# EAGLE design Hat_MCP3912 (EAGLE 6.5.0)
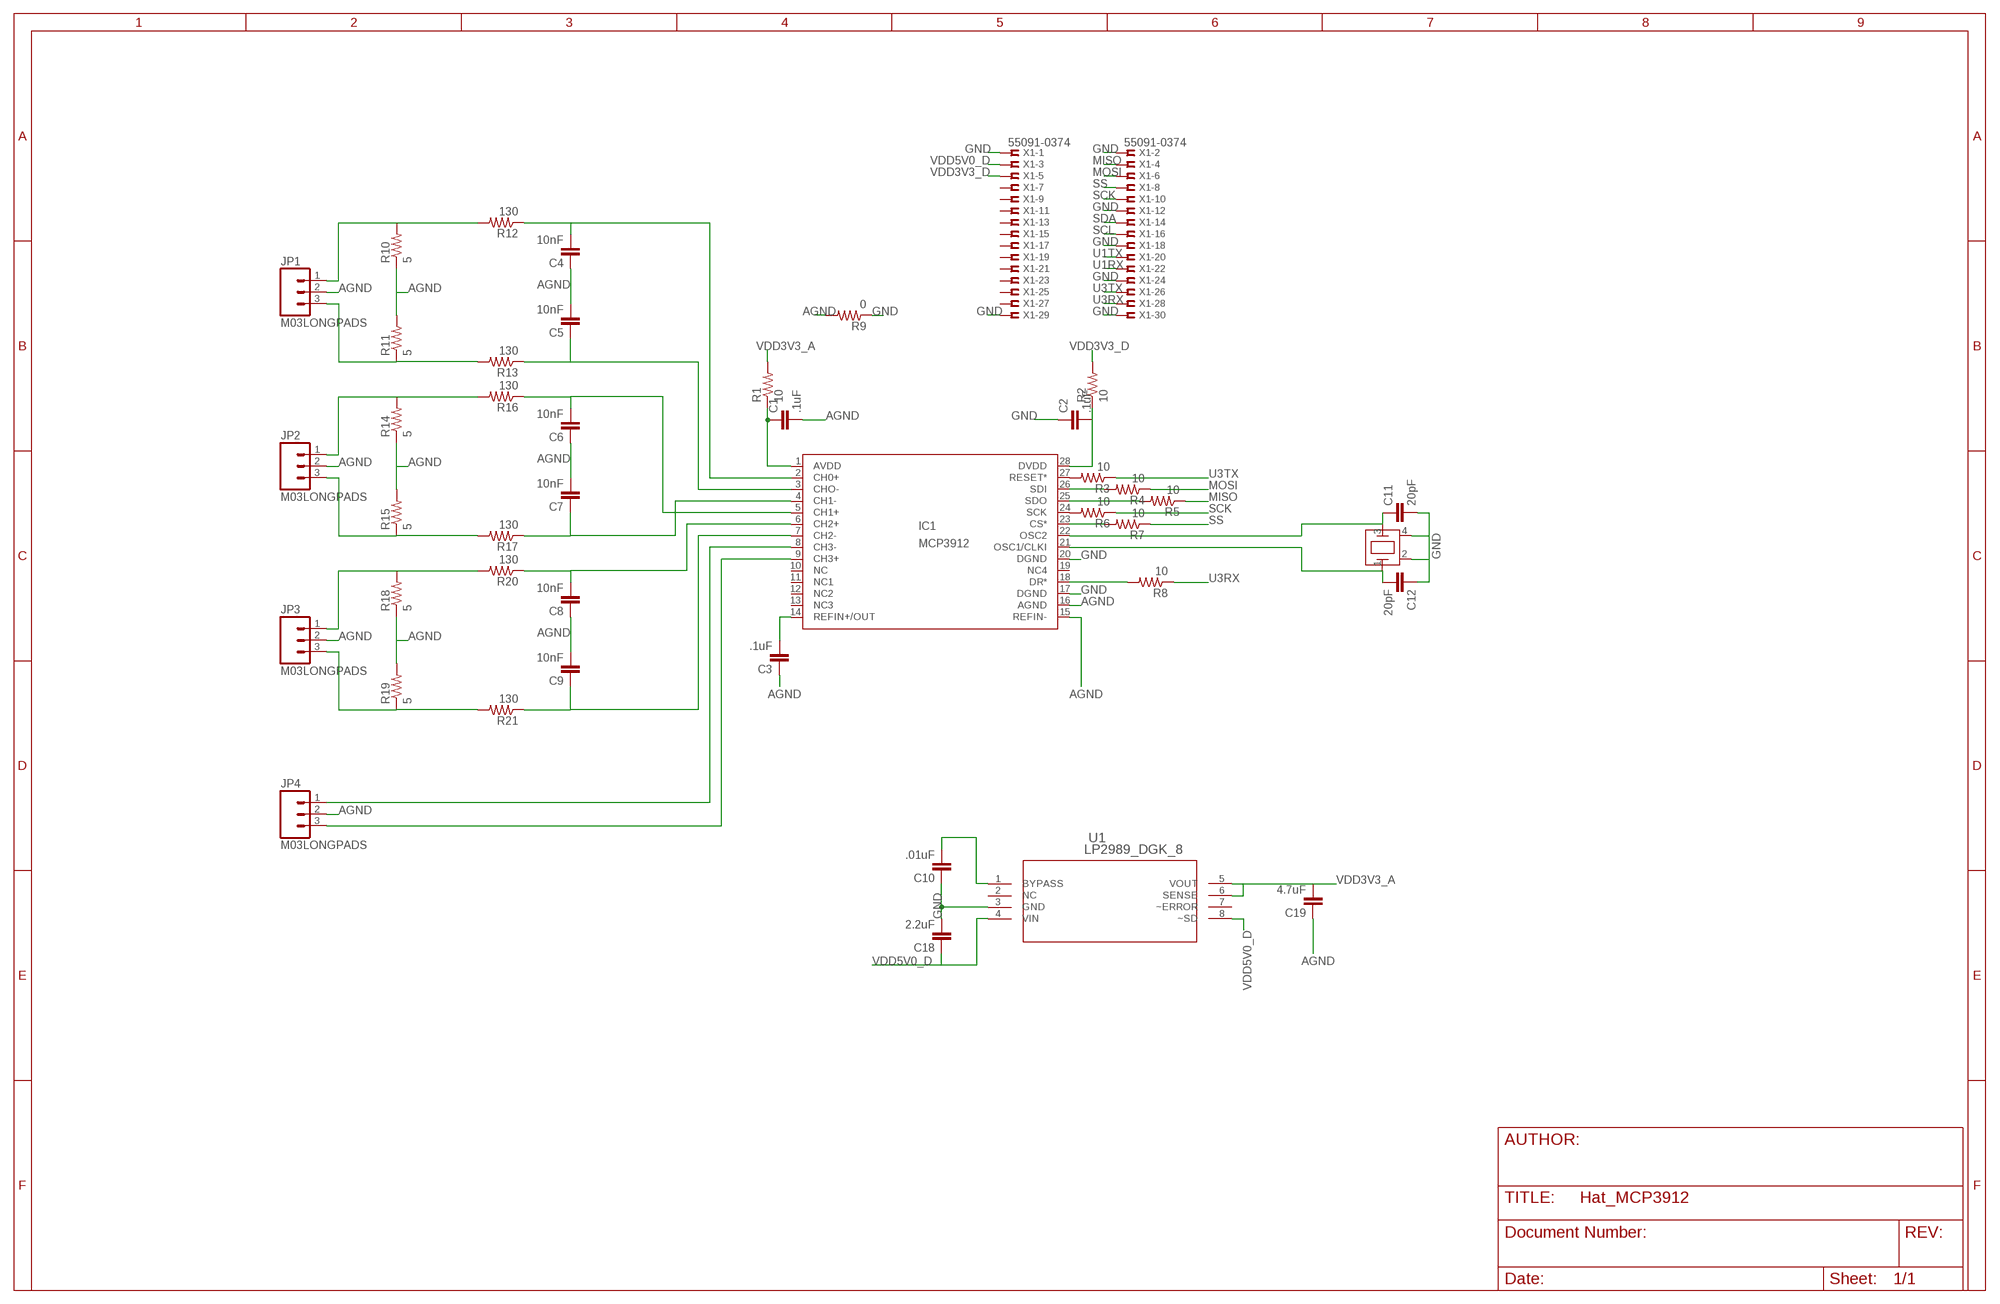
[diagram p0: schematic, sheet 1]

## Parts
C1  .1uF  CAP0805  [0805]
C2  .1uF  CAP0805  [0805]
C3  .1uF  CAP0805  [0805]
C4  10nF  CAP0805  [0805]
C5  10nF  CAP0805  [0805]
C6  10nF  CAP0805  [0805]
C7  10nF  CAP0805  [0805]
C8  10nF  CAP0805  [0805]
C9  10nF  CAP0805  [0805]
C10  .01uF  CAP0805  [0805]
C11  20pF  CAP0805  [0805]
C12  20pF  CAP0805  [0805]
C18  2.2uF  CAP0805  [0805]
C19  4.7uF  CAP0805  [0805]
IC1  MCP3912  [SSOP28]
JP1  M03LONGPADS  [1X03_LONGPADS]
JP2  M03LONGPADS  [1X03_LONGPADS]
JP3  M03LONGPADS  [1X03_LONGPADS]
JP4  M03LONGPADS  [1X03_LONGPADS]
R1  10  RESISTOR0805-RES  [0805]
R2  10  RESISTOR0805-RES  [0805]
R3  10  RESISTOR0805-RES  [0805]
R4  10  RESISTOR0805-RES  [0805]
R5  10  RESISTOR0805-RES  [0805]
R6  10  RESISTOR0805-RES  [0805]
R7  10  RESISTOR0805-RES  [0805]
R8  10  RESISTOR0805-RES  [0805]
R9  0  RESISTOR0805-RES  [0805]
R10  5  RESISTOR0805-RES  [0805]
R11  5  RESISTOR0805-RES  [0805]
R12  130  RESISTOR0805-RES  [0805]
R13  130  RESISTOR0805-RES  [0805]
R14  5  RESISTOR0805-RES  [0805]
R15  5  RESISTOR0805-RES  [0805]
R16  130  RESISTOR0805-RES  [0805]
R17  130  RESISTOR0805-RES  [0805]
R18  5  RESISTOR0805-RES  [0805]
R19  5  RESISTOR0805-RES  [0805]
R20  130  RESISTOR0805-RES  [0805]
R21  130  RESISTOR0805-RES  [0805]
U1  LP2989_DGK_8  [MUA08A]
U$1  7M-12.000MEEQ-T  [7M-CRYSTAL]
X1  55091-0374  [55091-0374]

## Nets
AGND: C1.2 C3.1 C4.1 C5.2 C6.1 C7.2 C8.1 C9.2 C19.1 IC1.15(REFIN-) IC1.16(AGND) JP1.2 JP2.2 JP3.2 JP4.2 R9.2 R10.1 R11.2 R14.1 R15.2 R18.1 R19.2
GND: C2.1 C10.1 C11.2 C12.1 C18.2 IC1.17(DGND) IC1.20(DGND) R9.1 U1.3(GND) U$1.2(GND1) U$1.4(GND2) X1.1 X1.2 X1.12 X1.18 X1.24 X1.29 X1.30
MISO: R5.1 X1.4
MOSI: R4.1 X1.6
N$1: C1.1 IC1.1(AVDD) R1.1
N$2: IC1.27(RESET*) R3.2
N$3: IC1.26(SDI) R4.2
N$4: IC1.25(SDO) R5.2
N$5: IC1.24(SCK) R6.2
N$6: IC1.23(CS*) R7.2
N$7: IC1.18(DR*) R8.2
N$8: C2.2 IC1.28(DVDD) R2.1
N$9: C3.2 IC1.14(REFIN+/OUT)
N$10: JP1.1 R10.2 R12.2
N$11: JP1.3 R11.1 R13.2
N$12: JP2.1 R14.2 R16.2
N$13: C4.2 IC1.2(CH0+) R12.1
N$14: C5.1 IC1.3(CHO-) R13.1
N$15: JP2.3 R15.1 R17.2
N$16: C6.2 IC1.5(CH1+) R16.1
N$17: C7.1 IC1.4(CH1-) R17.1
N$18: JP3.1 R18.2 R20.2
N$19: JP3.3 R19.1 R21.2
N$20: C8.2 IC1.6(CH2+) R20.1
N$21: C9.1 IC1.7(CH2-) R21.1
N$22: IC1.8(CH3-) JP4.1
N$23: IC1.9(CH3+) JP4.3
N$24: C10.2 U1.1(BYPASS)
N$26: C11.1 IC1.22(OSC2) U$1.3(OSC2)
N$27: C12.2 IC1.21(OSC1/CLKI) U$1.1(OSC1)
SCK: R6.1 X1.10
SCL: X1.16
SDA: X1.14
SS: R7.1 X1.8
U1RX: X1.22
U1TX: X1.20
U3RX: R8.1 X1.28
U3TX: R3.1 X1.26
VDD3V3_A: C19.2 R1.2 U1.5(VOUT) U1.6(SENSE)
VDD3V3_D: R2.2 X1.5
VDD5V0_D: C18.1 U1.4(VIN) U1.8(~SD) X1.3
Unconnected: IC1.10(NC) IC1.11(NC1) IC1.12(NC2) IC1.13(NC3) IC1.19(NC4) U1.2(NC) U1.7(~ERROR) X1.7 X1.9 X1.11 X1.13 X1.15 X1.17 X1.19 X1.21 X1.23 X1.25 X1.27

## Library data of the parts
C1-C12 C18 C19 = SensorCape:CAP: Capacitor Standard 0603 ceramic capacitor, and 0.1" leaded capacitor.
IC1 = SensorCape:MCP3912: edit this description Auto generated by make-symbol-device-package-bsdl.ulp Rev. 43 Source:
JP1-JP4 = SensorCape:M03: Header 3 Standard 3-pin 0.1" header. Use with straight break away headers (SKU : PRT-00116), right angle break away headers (PRT-00553), swiss pins (PRT-00743), machine pins (PRT-00117), and female headers (PRT-00115). Molex polarized connector foot print use with SKU : PRT-08232 with associated crimp pins and housings.
R1-R21 = SensorCape:RESISTOR: Resistor Basic schematic elements and footprints for 0603, 1206, and PTH resistors.
U1 = SensorCape:LP2989_DGK_8; BASE_PN: LP2989; COMP: TypeLDO; LIBRARY: ReferenceLP2989AIMM; PARTNUMBER: LP2989AIMM-25; PIN: Count8; SYMBOL: NameLP2989AIMM-25; TYPE: LP2989AIMM-2.5; VENDOR: NationalSemiconductor; VERSION: 1
U$1 = SensorCape:7M-12.000MEEQ-T
X1 = SensorCape:55091-0374: 0.635 mm PITCH B TO B CONN. Source: http://www.molex.com/pdm_docs/sd/550911609_sd.pdf; OC_FARNELL: unknown; OC_NEWARK: unknown

## Board
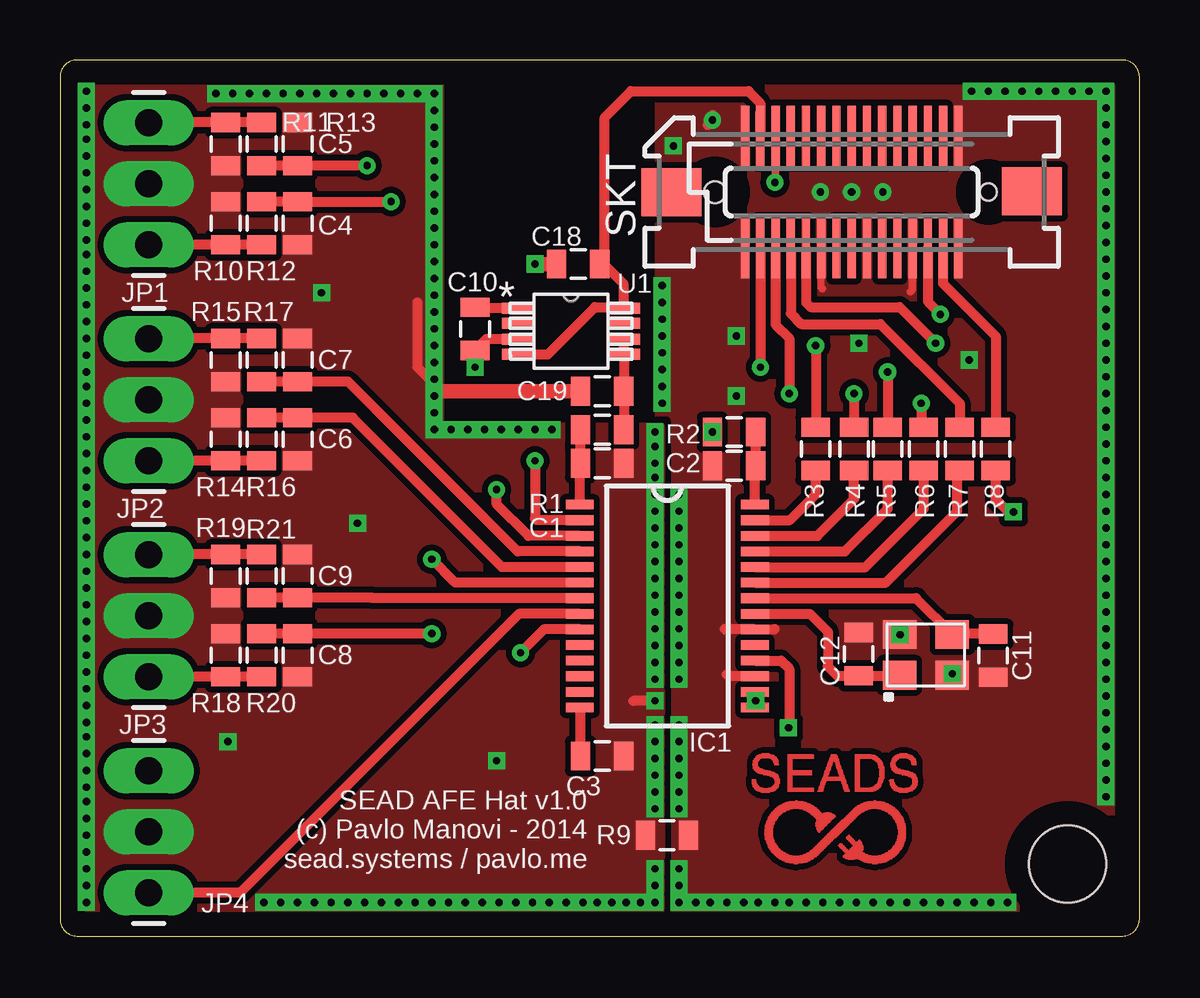
[diagram p1: board, top side]
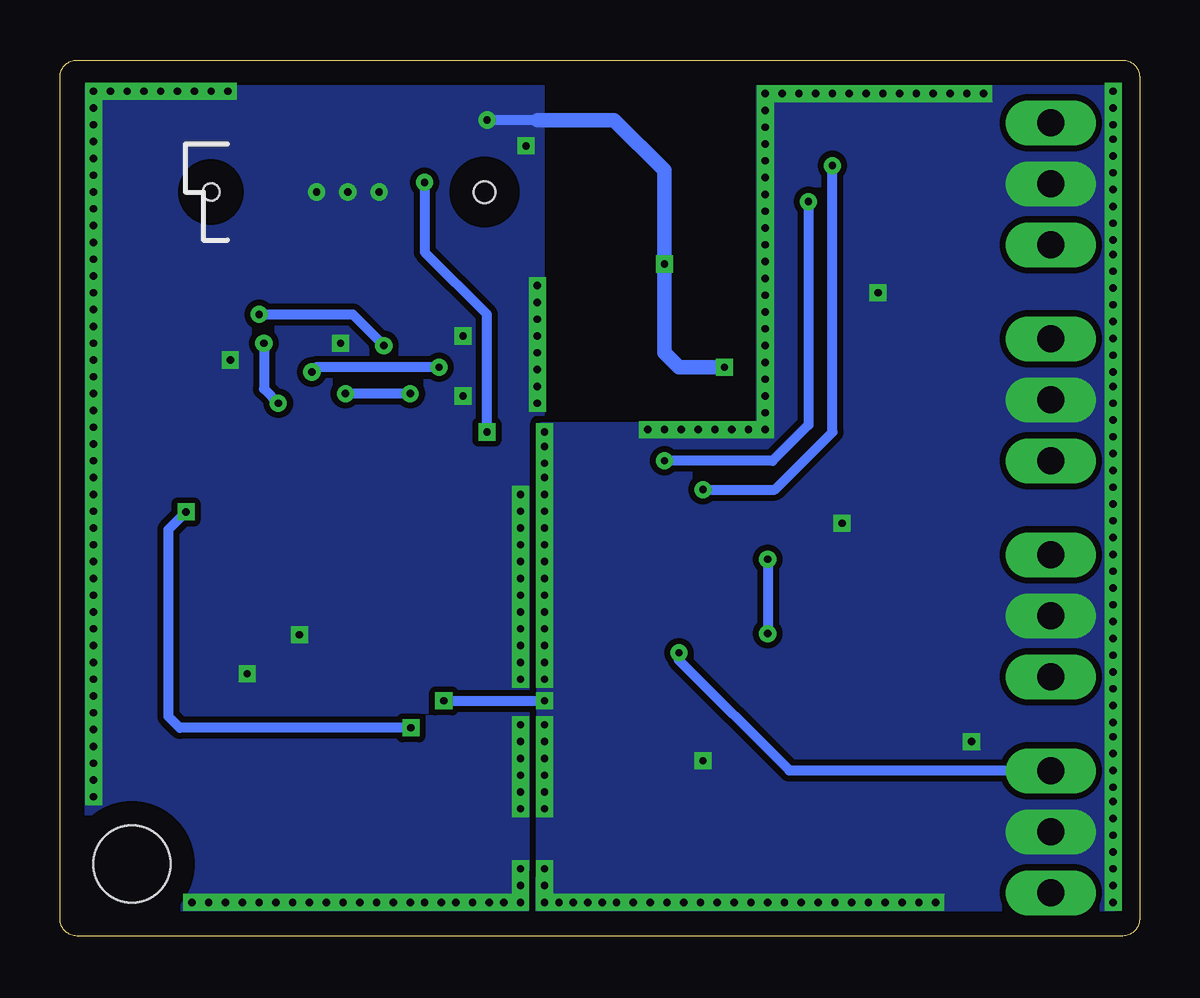
[diagram p2: board, bottom side, seen from below]

Size 45 x 36.5 mm. Coordinates in mm from the lower left corner, seen from the top.
Outline: 0,35.79 0,0.71 arc90 0.71,0 44.29,0 arc90 45,0.71 45,35.79 arc90 44.29,36.5 0.71,36.5 arc90 0,35.79
Copper layers (1*16): Top 0.035mm / dielectric 1.5mm / Bottom 0.035mm
Design rules "default": minimum track width 10mil, minimum drill 24mil, track to track 8mil, track to pad 8mil, pad to pad 8mil, via to via 8mil, smd to smd 8mil, copper to edge 40mil, drill to drill 8mil, minimum pad ring 10mil, minimum via ring 8mil, stop-mask expansion 4mil, vias tented up to drill 0mil, thermal gap 10mil
Holes 3.2 mm at 42,3

### Footprints (pad centres in the part's own frame; a part is rotated, then mirrored left to right if it is on the bottom)
0805 = smd 0.8 x 1.2: 1 -0.9,0; 2 0.9,0
SSOP28 = smd 1.154 x 0.4: 1 -3.65,4.225; 2 -3.65,3.575; 3 -3.65,2.925; 4 -3.65,2.275; 5 -3.65,1.625; 6 -3.65,0.975; 7 -3.65,0.325; 8 -3.65,-0.325; 9 -3.65,-0.975; 10 -3.65,-1.625; 11 -3.65,-2.275; 12 -3.65,-2.925; 13 -3.65,-3.575; 14 -3.65,-4.225; 15 3.65,-4.225; 16 3.65,-3.575; 17 3.65,-2.925; 18 3.65,-2.275; 19 3.65,-1.625; 20 3.65,-0.975; 21 3.65,-0.325; 22 3.65,0.325; 23 3.65,0.975; 24 3.65,1.625; 25 3.65,2.275; 26 3.65,2.925; 27 3.65,3.575; 28 3.65,4.225
1X03_LONGPADS = drill 1.118 pad 1.88 long: 1 0,0; 2 2.54,0; 3 5.08,0
MUA08A = smd 1.372 x 0.457: 1 -2.184,0.965; 2 -2.184,0.33; 3 -2.184,-0.33; 4 -2.184,-0.965; 5 2.184,-0.965; 6 2.184,-0.33; 7 2.184,0.33; 8 2.184,0.965
7M-CRYSTAL = smd 1.4 x 1.2: 1 -1.1,-0.85; 2 1.1,-0.85; 3 1.1,0.85; 4 -1.1,0.85
55091-0374 = smd 0.35 x 2.5: 1 -4.445,2.35; 2 -4.445,-2.35; 3 -3.81,2.35; 4 -3.81,-2.35; 5 -3.175,2.35; 6 -3.175,-2.35; 7 -2.54,2.35; 8 -2.54,-2.35; 9 -1.905,2.35; 10 -1.905,-2.35; 11 -1.27,2.35; 12 -1.27,-2.35; 13 -0.635,2.35; 14 -0.635,-2.35; 15 0,2.35; 16 0,-2.35; 17 0.635,2.35; 18 0.635,-2.35; 19 1.27,2.35; 20 1.27,-2.35; 21 1.905,2.35; 22 1.905,-2.35; 23 2.54,2.35; 24 2.54,-2.35; 25 3.175,2.35; 26 3.175,-2.35; 27 3.81,2.35; 28 3.81,-2.35; 29 4.445,2.35; 30 4.445,-2.35 | smd 2.5 x 2: M1 -7.513,0; M2 7.513,0.025 | hole 0.9: -5.7,0 | hole 0.7: 5.7,0

### Placement (x,y rotation side)
C1  22.6,19.7 0 top
C2  28.1,19.6 0 top
C3  22.6,7.5 180 top
C4  9.9,29.7 90 top
C5  9.9,33 90 top
C6  9.9,20.7 90 top
C7  9.9,24 90 top
C8  9.9,11.7 90 top
C9  9.9,15 90 top
C10  17.3,25.3 90 top
C11  38.9,11.68 270 top
C12  33.29,11.74 270 top
C18  21.6,28 180 top
C19  22.6,22.7 0 top
IC1  25.32,13.75 0 top
JP1  3.7,28.8 90 top
JP2  3.7,19.8 90 top
JP3  3.7,10.8 90 top
JP4  3.7,1.8 90 top
R1  22.6,21.1 0 top
R2  28.1,21 180 top
R3  31.5,20.3 270 top
R4  33.1,20.3 270 top
R5  34.5,20.3 270 top
R6  36,20.3 270 top
R7  37.5,20.3 270 top
R8  39,20.3 270 top
R9  25.3,4.2 180 top
R10  6.9,29.7 270 top
R11  6.9,33 270 top
R12  8.4,29.7 270 top
R13  8.4,33 90 top
R14  6.9,20.7 270 top
R15  6.9,24 270 top
R16  8.4,20.7 270 top
R17  8.4,24 90 top
R18  6.9,11.7 270 top
R19  6.9,15 270 top
R20  8.4,11.7 270 top
R21  8.4,15 90 top
U1  21.3,25.2 0 top
U$1  36.1,11.71 0 top
X1  33,31 0 top

### Tracks (layer width: path | path; a pad name or v marks a point on that pad's centre or on a via)
AGND  (via drill 0.3)
  Top 0.406: IC1.16 IC1.15 29,9.55 v29,9.8 | v24.8,9.8 23.9,9.8 | 15.9,22.7 14.9,23.7 14.9,26.4 | v1.1,33.8 v1.1,33.2 | v1.1,32.5 v1.1,31.8 | v1.1,31.1 v1.1,30.4 | v1.1,29 v1.1,28.4 v1.1,27.7 | v1.1,24.9 v1.1,24.2 | v1.1,22.2 v1.1,21.5 | v1.1,20.8 v1.1,20.1 | v1.1,19.4 v1.1,18.7 | v1.1,15.9 v1.1,15.2 | v1.1,14.5 v1.1,13.8 | v1.1,13.1 v1.1,12.4 | v1.1,11.7 v1.1,11 | v1.1,10.3 v1.1,9.6 | v1.1,7.6 v1.1,6.9 | v1.1,4.9 v1.1,4.2 | v1.1,2.8 v1.1,2.1 v1.1,1.4
  Top 0.61: C19.1 15.9,22.7
  Bottom 0.406: v29,9.8 v24.8,9.8
  other vias: 9.9,1.4 10.6,1.4 11.3,1.4 12,1.4 12.7,1.4 13.4,1.4 14.1,1.4 14.8,1.4 15.5,1.4 16.2,1.4 16.9,1.4 17.6,1.4 18.3,1.4 19,1.4 19.7,1.4 20.4,1.4 21.1,1.4 21.8,1.4 22.4,1.4 23,1.4 23.6,1.4 24.2,1.4 9.2,1.4 8.5,1.4 1.1,3.5 1.1,5.6 1.1,6.2 1.1,8.3 1.1,8.9 1.1,16.6 1.1,17.3 1.1,18 1.1,22.9 1.1,23.5 1.1,25.6 1.1,26.3 1.1,27 1.1,29.7 1.1,35.2 1.1,34.5 24.8,10.7 24.8,11.4 24.8,12.1 24.8,12.8 24.8,13.5 24.8,14.2 24.8,14.9 24.8,15.6 24.8,16.3 24.8,17 24.8,17.7 24.8,18.4 24.8,19.1 24.8,19.7 24.8,20.4 24.8,21 18.2,7.3 7,8.1 24.8,8.8 24.8,8.1 24.8,7.4 24.8,6.7 24.8,6 24.8,5.3 24.8,2.8 24.8,2.1 15.6,35.1 15.6,34.4 15.6,33.7 15.6,33 15.6,32.3 15.6,31.6 15.6,30.9 15.6,30.2 15.6,29.5 15.6,28.8 15.6,28.1 15.6,27.4 15.6,26.7 15.6,26 15.6,25.3 15.6,24.6 15.6,23.9 15.6,23.2 15.6,22.5 15.6,21.8 15.6,21.1 16.3,21.1 17,21.1 17.7,21.1 18.4,21.1 19.1,21.1 19.8,21.1 20.5,21.1 24.8,1.4 14.9,35.1 14.2,35.1 13.5,35.1 12.8,35.1 12.1,35.1 11.4,35.1 10.7,35.1 10,35.1 9.3,35.1 8.6,35.1 7.9,35.1 7.2,35.1 6.5,35.1 12.4,17.2 10.9,26.8
  pour Top (isolate 0.254, no thermals): -0.9,37 15.8,37 15.8,21.2 25,21.2 25,0 -0.9,0
  pour Bottom (isolate 0.254, no thermals): -0.9,37 15.8,37.2 15.8,21.2 24.9,21.2 24.9,19.7 25,0 -0.9,0
GND  (via drill 0.3)
  Top 0.305: X1.12 31.71,27.05 31.79,26.98 | X1.24 35.52,26.92 35.45,26.85
  Top 0.406: 29.8,12.8 29.77,12.78 IC1.20 27.73,12.78 27.7,12.8 | IC1.17 27.88,10.82 27.8,10.9 | U1.3 17.77,24.87 C10.1 | v27.2,34 27.2,34.2 27,33.8
  Top 0.61: v19.8,28 C18.2 | C10.1 v17.3,23.7
  Bottom 0.406: 25.1,34 v27.2,34
  Bottom 0.61: 25.1,34 21.9,34 19.8,31.9 v19.8,28 19.8,24.3 19.2,23.7 v17.3,23.7
  other vias: 31.7,31 33,31 34.3,31 43.6,35.2 43.6,34.5 43.6,33.8 43.6,33.1 43.6,32.4 43.6,31.7 43.6,31 42.9,35.2 42.2,35.2 41.5,35.2 40.8,35.2 40.1,35.2 39.4,35.2 38.7,35.2 38,35.2 43.6,30.3 43.6,29.6 43.6,28.9 43.6,28.2 43.6,27.5 43.6,26.8 43.6,26.1 43.6,25.4 43.6,24.7 43.6,24 43.6,23.3 43.6,22.6 43.6,21.9 43.6,21.2 43.6,20.5 43.6,19.8 43.6,19.1 43.6,18.4 43.6,17.7 43.6,17 43.6,16.3 43.6,15.6 43.6,14.9 43.6,14.2 43.6,13.5 43.6,12.8 43.6,12.1 43.6,11.4 43.6,10.7 43.6,10 43.6,9.3 43.6,8.6 43.6,7.9 43.6,7.2 43.6,6.5 43.6,5.8 39.5,1.4 38.8,1.4 38.1,1.4 37.4,1.4 36.7,1.4 36,1.4 35.3,1.4 34.6,1.4 33.9,1.4 33.2,1.4 32.5,1.4 31.8,1.4 31.1,1.4 30.4,1.4 29.8,1.4 29.1,1.4 28.5,1.4 27.8,1.4 27.1,1.4 26.5,1.4 25.8,2.1 25.8,2.8 25.8,5.3 25.8,6 25.8,6.7 25.8,7.4 25.8,8.1 25.8,8.8 25.8,10.7 25.8,11.4 25.8,12.1 25.8,12.8 25.8,13.5 25.8,14.2 25.8,14.9 25.8,15.6 25.8,16.3 25.8,17 25.8,17.7 25.8,18.4 25.1,22.2 25.1,22.9 25.1,23.6 25.1,24.3 25.1,25 25.1,25.7 25.1,26.4 25.1,27.1 25.57,32.92 37.9,24 33.3,24.7 28.2,25 28.2,22.5 25.8,1.4 35.01,12.55 37.2,10.92
  pour Top (isolate 0.254, rank 2, no thermals): 25,37 45,37 45,0 25,0
  pour Bottom (isolate 0.254, rank 2, no thermals): 25,37 45,37 45,0 25,0
MISO  (via drill 0.3)
  Top 0.406: v34.5,23.5 R5.1 | X1.4 v29.19,23.71 v29.2,23.7
  Bottom 0.406: v29.2,23.7 34.3,23.7 v34.5,23.5
MOSI  (via drill 0.3)
  Top 0.406: v30.4,22.6 30.4,24.9 29.82,25.48 X1.6 | v33.1,22.6 R4.1
  Bottom 0.406: v30.4,22.6 v33.1,22.6
N$1
  Top 0.406: IC1.1 21.67,19.67 C1.1 R1.1
N$2
  Top 0.406: IC1.27 30.43,17.32 31.5,18.4 R3.2
N$3
  Top 0.406: IC1.26 31.57,16.68 33.1,18.2 R4.2
N$4
  Top 0.406: IC1.25 32.73,16.02 34.5,17.8 R5.2
N$5
  Top 0.406: IC1.24 33.58,15.38 36,17.8 R6.2
N$6
  Top 0.406: IC1.23 34.42,14.72 37.4,17.7 37.4,19.3 R7.2
N$7  (via drill 0.3)
  Top 0.406: R8.2 39,18.2 39.53,17.67 v39.75,17.67 | IC1.18 30.05,11.47 30.4,11.13 30.4,8.71 v30.37,8.68
  Bottom 0.406: v39.75,17.67 40.48,16.94 40.48,9.14 40.01,8.68 v30.37,8.68
N$8
  Top 0.406: IC1.28 28.97,19.57 C2.2 R2.1
N$9
  Top 0.406: C3.2 21.7,9.49 IC1.14
N$10
  Top 0.406: R12.2 R10.2 JP1.1
N$11
  Top 0.406: R13.2 R11.1 3.72,33.9 JP1.3
N$12
  Top 0.406: R16.2 R14.2 JP2.1
N$13  (via drill 0.3)
  Top 0.406: R12.1 C4.2 v13.8,30.6 | v19.8,19.8 19.8,17.4 19.88,17.32 IC1.2
  Bottom 0.406: v13.8,30.6 13.8,21.3 15.3,19.8 v19.8,19.8
N$14  (via drill 0.3)
  Top 0.406: R13.1 C5.1 v12.8,32.1 | IC1.3 19.52,16.68 18.2,18 v18.2,18.6
  Bottom 0.406: v18.2,18.6 15.2,18.6 12.8,21 v12.8,32.1
N$15
  Top 0.406: R17.2 R15.1 3.72,24.9 JP2.3
N$16
  Top 0.406: IC1.5 18.43,15.38 12.2,21.6 C6.2 R16.1
N$17
  Top 0.406: IC1.4 19.07,16.02 12,23.1 C7.1 R17.1
N$18
  Top 0.406: R20.2 R18.2 JP3.1
N$19
  Top 0.406: R21.2 R19.1 3.72,15.9 JP3.3
N$20  (via drill 0.3)
  Top 0.406: IC1.6 16.48,14.72 v15.5,15.7 | v15.5,12.6 C8.2 R20.1
  Bottom 0.406: v15.5,15.7 v15.5,12.6
N$21
  Top 0.406: IC1.7 13.03,14.07 13,14.1 C9.1 R21.1
N$22
  Top 0.406: IC1.8 19.12,13.43 7.5,1.8 JP4.1
N$23  (via drill 0.3)
  Top 0.406: IC1.9 20.18,12.78 v19.2,11.8
  Bottom 0.406: JP4.3 3.72,6.9 14.6,6.9 19.2,11.5 v19.2,11.8
N$24
  Top 0.406: U1.1 17.34,26.16 C10.2
N$25
  Top 0.025: 29.9,3.27 31.45,3.27
N$26
  Top 0.406: IC1.22 35.68,14.07 U$1.3 37.22,12.58 C11.1
N$27
  Top 0.406: IC1.21 31.26,13.43 32.01,12.68 32.01,11.25 32.41,10.84 C12.2 34.98,10.84 U$1.1
SCK  (via drill 0.3)
  Top 0.406: v36.5,24.7 35,26.2 31.3,26.2 31.09,26.41 X1.10 | v35.9,22.2 35.9,21.3 R6.1
  Bottom 0.406: v36.5,24.7 36.5,22.8 v35.9,22.2
SS
  Top 0.406: R7.1 37.5,22.2 34.2,25.5 30.9,25.5 30.46,25.94 X1.8
U3RX
  Top 0.406: R8.1 39,25 36.81,27.19 X1.28
U3TX  (via drill 0.3)
  Top 0.406: v31.5,24.6 R3.1 | v36.7,25.9 36.18,26.43 X1.26
  Bottom 0.406: v31.5,24.6 32.8,25.9 v36.7,25.9
VDD3V3_A
  Top 0.406: 23.48,22.72 C19.2 | U1.6 U1.5 23.5,24.22 C19.2 | C19.2 R1.2
VDD3V3_D  (via drill 0.3)
  Top 0.305: 29.82,31.52 X1.5
  Top 0.406: 29.82,31.52 v29.8,31.4
  Bottom 0.406: v29.8,31.4 29.8,28.5 27.2,25.9 R2.2
  other vias: 27.2,21
VDD5V0_D
  Top 0.406: U1.4 20.34,24.23 22.3,26.2 23.45,26.2 U1.8 23.48,27.18 22.67,28 C18.1 22.7,28.2 22.7,34.1 23.8,35.2 28.7,35.2 29.19,34.69 29.19,34.3 | 29.19,34.3 X1.3 | X1.3 29.19,34.27 29.19,34.3
(copper drawn outside any net)
  shapes: Top area x730

### Text on the board
tNames: SEAD AFE Hat v1.0 / (c) Pavlo Manovi - 2014 / sead.systems / pavlo.me